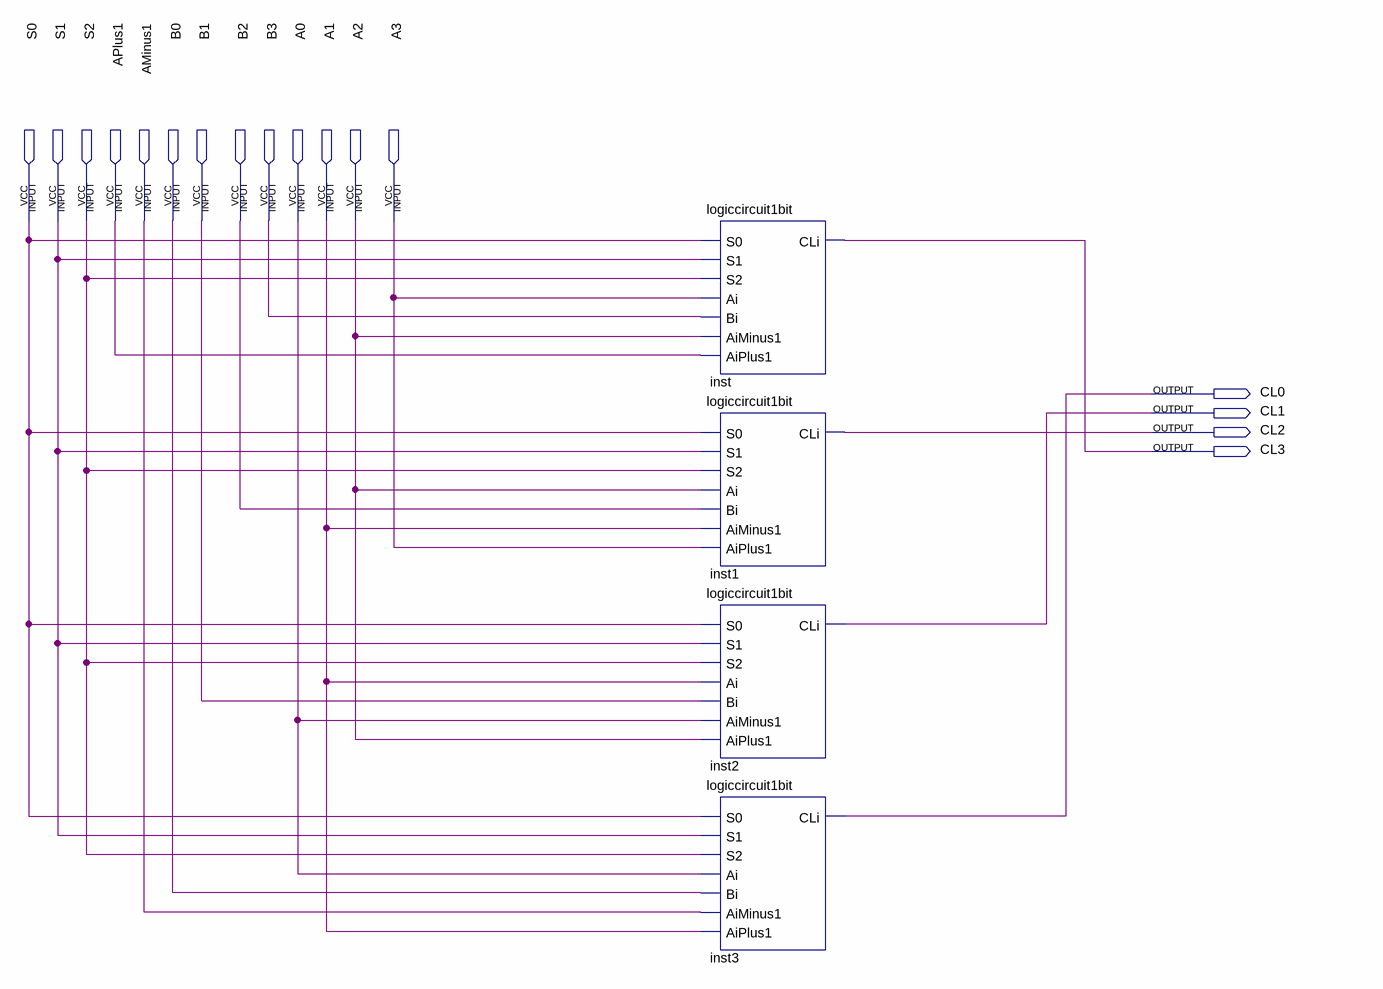
[diagram p0: schematic sheet]
// Quartus schematic Logiccircuit4bit.bdf as structural Verilog: 4 symbols, 17 pins
module Logiccircuit4bit (
  input  S0,
  input  S1,
  input  S2,
  input  APlus1,
  input  AMinus1,
  input  B0,
  input  B1,
  input  B2,
  input  B3,
  input  A0,
  input  A1,
  input  A2,
  input  A3,
  output CL0,
  output CL1,
  output CL2,
  output CL3
);

  logiccircuit1bit inst (.S0(S0), .S1(S1), .S2(S2), .Ai(A3), .Bi(B3), .AiMinus1(A2), .AiPlus1(APlus1), .CLi(CL3));
  logiccircuit1bit inst1 (.S0(S0), .S1(S1), .S2(S2), .Ai(A2), .Bi(B2), .AiMinus1(A1), .AiPlus1(A3), .CLi(CL2));
  logiccircuit1bit inst2 (.S0(S0), .S1(S1), .S2(S2), .Ai(A1), .Bi(B1), .AiMinus1(A0), .AiPlus1(A2), .CLi(CL1));
  logiccircuit1bit inst3 (.S0(S0), .S1(S1), .S2(S2), .Ai(A0), .Bi(B0), .AiMinus1(AMinus1), .AiPlus1(A1), .CLi(CL0));
endmodule
